# Altium schematic sheet Sexy Rodent.SchDoc (part 1 of 3)
size A4
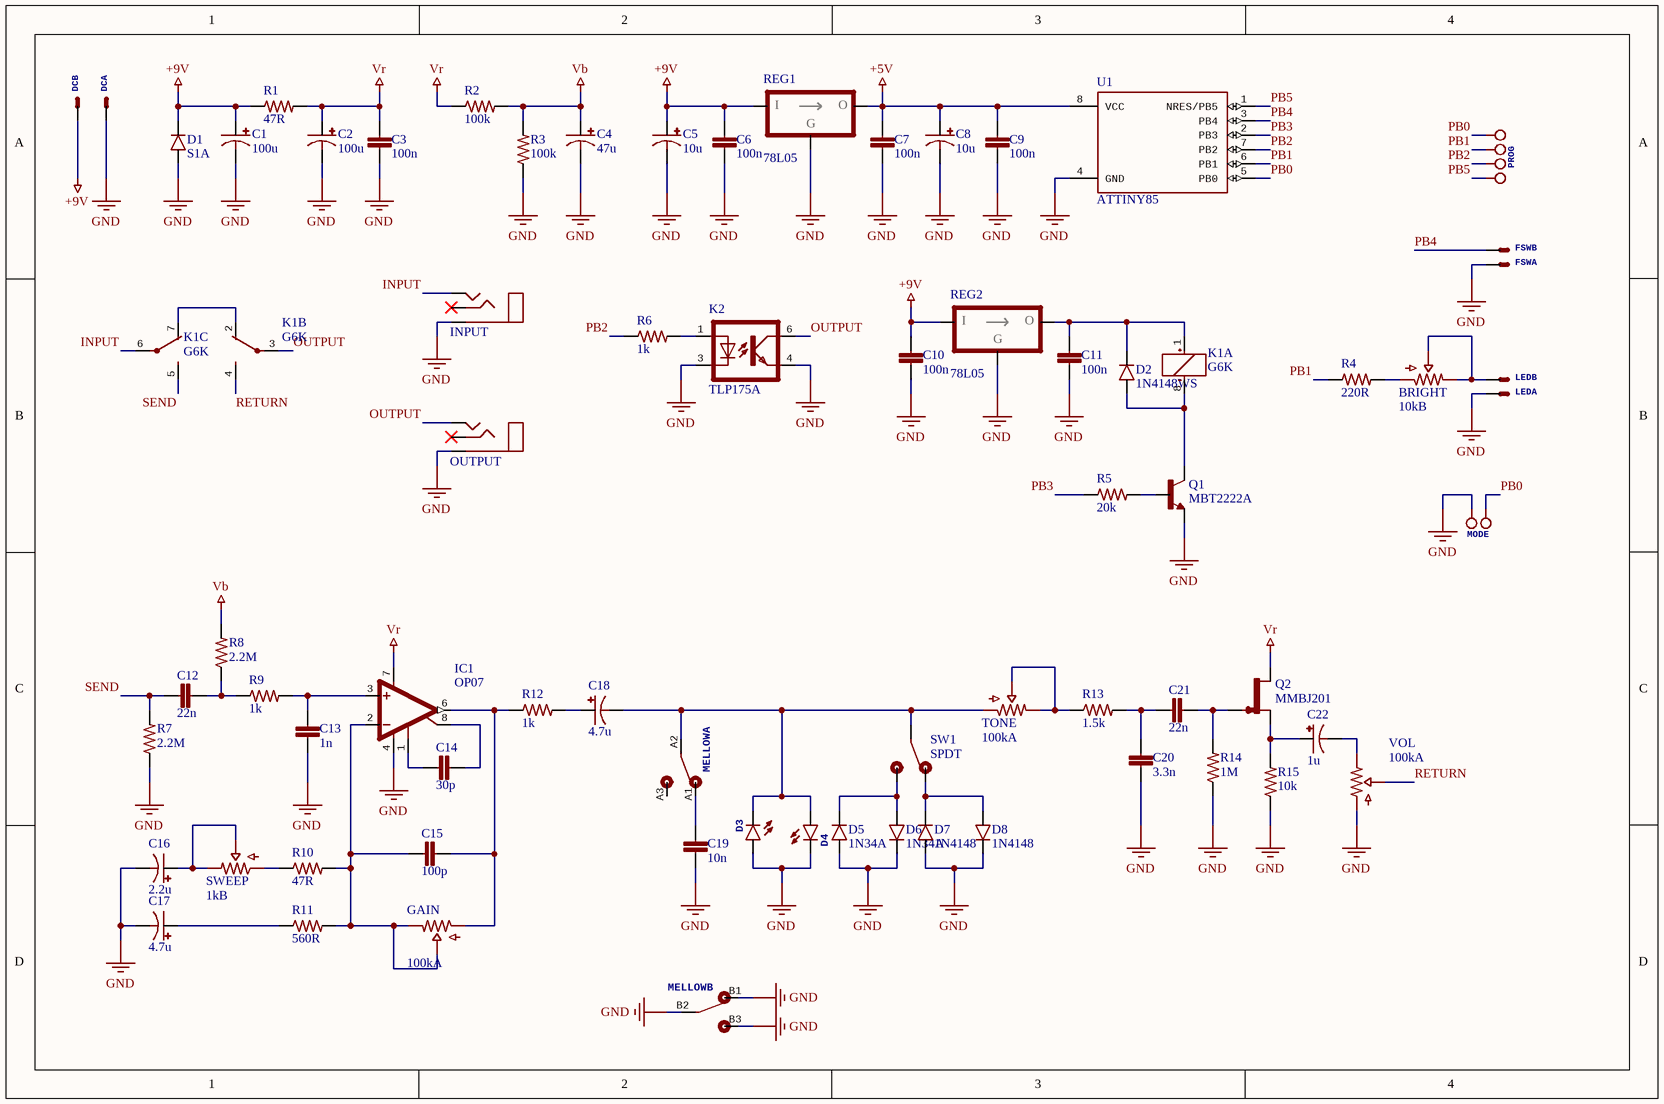
[diagram p0: Sexy Rodent.SchDoc]

## Parts
BRIGHT  10kB  [BOURNS_3362P]
C1  100u  [CAPAE_D]
C2  100u  [CAPAE_D]
C3  100n  [CHIP_0603]
C4  47u  [CAPAE_D]
C5  10u  [CAPAE_B]
C6  100n  [CHIP_0603]
C7  100n  [CHIP_0603]
C8  10u  [CAPAE_B]
C9  100n  [CHIP_0603]
C10  100n  [CHIP_0603]
C11  100n  [CHIP_0603]
C12  22n  [CHIP_0805]
C13  1n  [CHIP_0603]
C14  30p  [CHIP_0603]
C15  100p  [CHIP_0603]
C16  2.2u  [CAPAE_B]
C17  4.7u  [CAPAE_C]
C18  4.7u  [CAPAE_C]
C19  10n  [CHIP_0603]
C20  3.3n  [CHIP_0603]
C21  22n  [CHIP_0805]
C22  1u  [CAPAE_B]
D1  S1A  [DO214]
D2  1N4148WS  [SOD323]
D3  D_LED  [LED_3MM]  (value not drawn)
D4  D_LED  [LED_3MM]  (value not drawn)
D5  1N34A  [DO7_4]
D6  1N34A  [DO7_4]
D7  1N4148  [DO35_2]
D8  1N4148  [DO35_2]
DC  J_JST-XH-02  [JST-XH-02]  (value not drawn)  (parts A,B of 2)
FSW  J_JST-XH-02  [JST-XH-02]  (value not drawn)  (parts A,B of 2)
GAIN  100kA  [ALPHA_16mm_BOTTOM]
IC1  OP07  [SO-8]
INPUT  J_STEREO  [STEREO]  (value not drawn)
K1  G6K  [G6K]  (parts A,B,C of 3)
K2  TLP175A  [TLP175A]
LED  J_JST-XH-02  [JST-XH-02]  (value not drawn)  (parts A,B of 2)
MELLOW  DPDT  [DPDT_SLIDE]  (value not drawn)  (parts A,B of 2)
MODE  (no value)  [HEADER_2PINS]
OUTPUT  J_STEREO  [STEREO]  (value not drawn)
PROG  J_HEADER_4PINS_FEM  [HEADER_4Pins_FEM]  (value not drawn)
Q1  MBT2222A  [SOT323]
Q2  MMBJ201  [SOT23]
R1  47R  [CHIP_R_1206]
R2  100k  [CHIP_R_1206]
R3  100k  [CHIP_R_1206]
R4  220R  [CHIP_R_1206]
R5  20k  [CHIP_R_0603]
R6  1k  [CHIP_R_0603]
R7  2.2M  [CHIP_R_0603]
R8  2.2M  [CHIP_R_0603]
R9  1k  [CHIP_R_0603]
R10  47R  [CHIP_R_0603]
R11  560R  [CHIP_R_0603]
R12  1k  [CHIP_R_0603]
R13  1.5k  [CHIP_R_0603]
R14  1M  [CHIP_R_0603]
R15  10k  [CHIP_R_0603]
REG1  78L05  [SOT23-3]
REG2  78L05  [SOT23-3]
SW1  SPDT  [SPDT]
SWEEP  1kB  [ALPHA_16mm_BOTTOM]
TONE  100kA  [ALPHA_16mm_BOTTOM]
U1  ATTINY85  [SOP8]
VOL  100kA  [ALPHA_16mm_BOTTOM]

## Nets
+5V: C7.1 C8.+ C9.1 REG1.1(OUTPUT) U1.8(VCC)
+9V: C1.+ C5.+ C6.1 C10.1 D1.1 DC.1(S) R1.1 REG1.2(INPUT) REG2.2(INPUT)
GND: C1.- C2.- C3.2 C4.- C5.- C6.2 C7.2 C8.- C9.2 C10.2 C11.2 C13.2 C16.- C17.- C19.2 C20.2 D1.2 D3.ANODE(A) D4.P$1(C) D5.A D6.C D7.A D8.C DC.2(S) FSW.2(S) IC1.4(V-) INPUT.S K2.3(C) K2.4(EMIT) LED.2(S) MELLOW.B1 MELLOW.B2 MELLOW.B3 MODE.1 OUTPUT.S Q1.2(E) R3.1 R7.1 R14.1 R15.1 REG1.3(COMMON) REG2.3(COMMON) U1.4(GND) VOL.1
Vb: C4.+ R2.2 R3.2 R8.2
Vr: C2.+ C3.1 IC1.7(V+) Q2.1(D) R1.2 R2.1
INPUT: INPUT.T K1.6(P)
OUTPUT: K1.3(P) K2.6(COL) OUTPUT.T
PB0: MODE.2 PROG.4 U1.5(PB0)
PB1: PROG.3 R4.1 U1.6(PB1)
PB2: PROG.2 R6.1 U1.7(PB2)
PB3: R5.1 U1.2(PB3)
PB4: FSW.1(S) U1.3(PB4)
PB5: PROG.1 U1.1(NRES/PB5)
RETURN: K1.4(S) VOL.2
SEND: C12.2 K1.5(S) R7.2
NetBRIGHT_1: BRIGHT.1 R4.2
NetBRIGHT_2: BRIGHT.2 BRIGHT.3 LED.1(S)
NetC11_1: C11.1 D2.1 K1.1(+) REG2.1(OUTPUT)
NetC12_1: C12.1 R8.1 R9.1
NetC13_1: C13.1 IC1.3(+IN) R9.2
NetC14_1: C14.1 IC1.8(CMP2)
NetC14_2: C14.2 IC1.1(CMP1)
NetC15_1: C15.1 GAIN.1 IC1.6(OUT) R12.1
NetC15_2: C15.2 GAIN.2 GAIN.3 IC1.2(-IN) R10.2 R11.2
NetC16_+: C16.+ SWEEP.2 SWEEP.3
NetC17_+: C17.+ R11.1
NetC18_+: C18.+ R12.2
NetC18_-: C18.- D3.P$1(C) D4.ANODE(A) MELLOW.A2 SW1.2(P) TONE.1
NetC19_1: C19.1 MELLOW.A1
NetC20_1: C20.1 C21.2 R13.2
NetC21_1: C21.1 Q2.3(G) R14.2
NetC22_+: C22.+ Q2.2(S) R15.2
NetC22_-: C22.- VOL.3
NetD2_2: D2.2 K1.8(-) Q1.3(C)
NetD5_C: D5.C D6.A SW1.3(S)
NetD7_C: D7.C D8.A SW1.1(O)
NetK1_2: K1.2(O) K1.7(O)
NetK2_1: K2.1(A) R6.2
NetQ1_1: Q1.1(B) R5.2
NetR10_1: R10.1 SWEEP.1
NetR13_1: R13.1 TONE.2 TONE.3

Not connected (* = marked no-connect by the designer): INPUT R*; MELLOW A3(3); OUTPUT R*